# Altium schematic sheet T35_6_DDR3.SchDoc
size A4
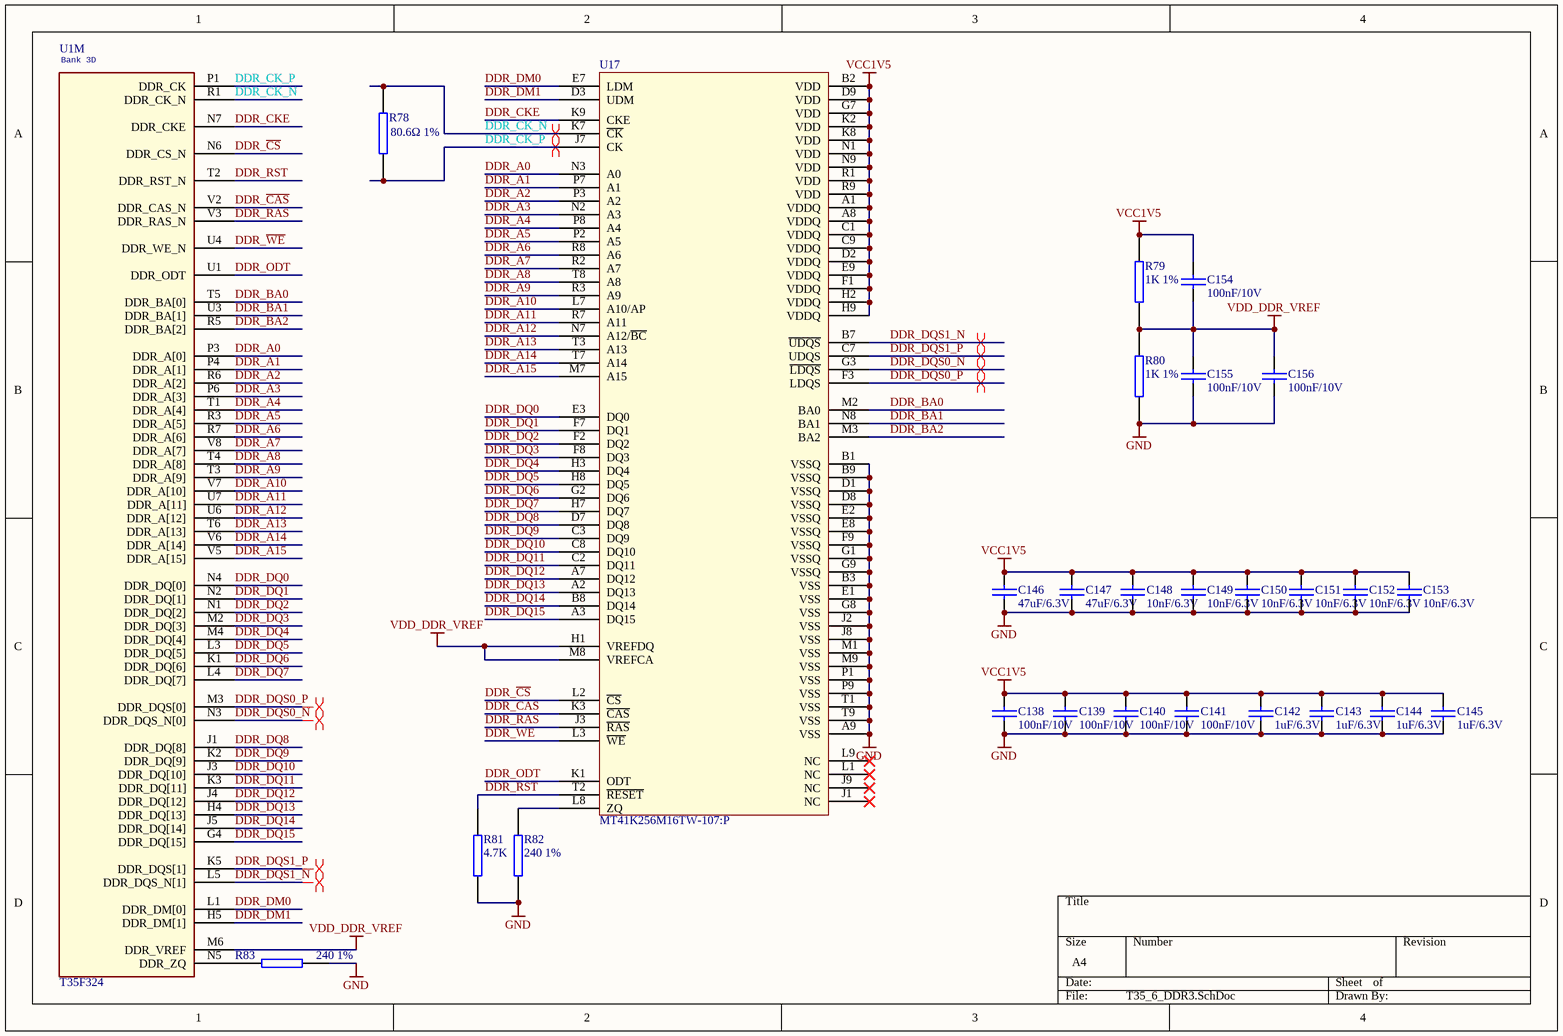
[diagram p0: T35_6_DDR3.SchDoc]

## Parts
C138  100nF/10V  [0201CS]
C139  100nF/10V  [0201CS]
C140  100nF/10V  [0201CS]
C141  100nF/10V  [0201CS]
C142  1uF/6.3V  [0201CS]
C143  1uF/6.3V  [0201CS]
C144  1uF/6.3V  [0201CS]
C145  1uF/6.3V  [0201CS]
C146  47uF/6.3V  [0603CS]
C147  47uF/6.3V  [0603CS]
C148  10nF/6.3V  [0201CS]
C149  10nF/6.3V  [0201CS]
C150  10nF/6.3V  [0201CS]
C151  10nF/6.3V  [0201CS]
C152  10nF/6.3V  [0201CS]
C153  10nF/6.3V  [0201CS]
C154  100nF/10V  [0201CS]
C155  100nF/10V  [0201CS]
C156  100nF/10V  [0201CS]
R78  80.6Ω 1%  [0402RS]
R79  1K 1%  [0402RS]
R80  1K 1%  [0402RS]
R81  4.7K  [0402RS]
R82  240 1%  [0201RS]
R83  240 1%  [0201RS]
U1  T35F324  [T35-F324-BGA100P9X9-81A]  (part M of 17)
U17  MT41K256M16TW-107:P  [MICT-TNA-96]

## Nets
GND: C138.2 C139.2 C140.2 C141.2 C142.2 C143.2 C144.2 C145.2 C146.2 C147.2 C148.2 C149.2 C150.2 C151.2 C152.2 C153.2 C155.2 C156.2 R80.1 R81.2 R82.2 R83.2 U17.A9(VSS) U17.B1(VSSQ) U17.B3(VSS) U17.B9(VSSQ) U17.D1(VSSQ) U17.D8(VSSQ) U17.E1(VSS) U17.E2(VSSQ) U17.E8(VSSQ) U17.F9(VSSQ) U17.G1(VSSQ) U17.G8(VSS) U17.G9(VSSQ) U17.J2(VSS) U17.J8(VSS) U17.M1(VSS) U17.M9(VSS) U17.P1(VSS) U17.P9(VSS) U17.T1(VSS) U17.T9(VSS)
VCC1V5: C138.1 C139.1 C140.1 C141.1 C142.1 C143.1 C144.1 C145.1 C146.1 C147.1 C148.1 C149.1 C150.1 C151.1 C152.1 C153.1 C154.1 R79.2 U17.A1(VDDQ) U17.A8(VDDQ) U17.B2(VDD) U17.C1(VDDQ) U17.C9(VDDQ) U17.D2(VDDQ) U17.D9(VDD) U17.E9(VDDQ) U17.F1(VDDQ) U17.G7(VDD) U17.H2(VDDQ) U17.H9(VDDQ) U17.K2(VDD) U17.K8(VDD) U17.N1(VDD) U17.N9(VDD) U17.R1(VDD) U17.R9(VDD)
VDD_DDR_VREF: C154.2 C155.1 C156.1 R79.1 R80.2 U1.M6(DDR_VREF) U17.H1(VREFDQ) U17.M8(VREFCA)
DDR_A0: U1.P3(DDR_A[0]) U17.N3(A0)
DDR_A1: U1.P4(DDR_A[1]) U17.P7(A1)
DDR_A2: U1.R6(DDR_A[2]) U17.P3(A2)
DDR_A3: U1.P6(DDR_A[3]) U17.N2(A3)
DDR_A4: U1.T1(DDR_A[4]) U17.P8(A4)
DDR_A5: U1.R3(DDR_A[5]) U17.P2(A5)
DDR_A6: U1.R7(DDR_A[6]) U17.R8(A6)
DDR_A7: U1.V8(DDR_A[7]) U17.R2(A7)
DDR_A8: U1.T4(DDR_A[8]) U17.T8(A8)
DDR_A9: U1.T3(DDR_A[9]) U17.R3(A9)
DDR_A10: U1.V7(DDR_A[10]) U17.L7(A10/AP)
DDR_A11: U1.U7(DDR_A[11]) U17.R7(A11)
DDR_A12: U1.U6(DDR_A[12]) U17.N7(A12/~{BC})
DDR_A13: U1.T6(DDR_A[13]) U17.T3(A13)
DDR_A14: U1.V6(DDR_A[14]) U17.T7(A14)
DDR_A15: U1.V5(DDR_A[15]) U17.M7(A15)
DDR_BA0: U1.T5(DDR_BA[0]) U17.M2(BA0)
DDR_BA1: U1.U3(DDR_BA[1]) U17.N8(BA1)
DDR_BA2: U1.R5(DDR_BA[2]) U17.M3(BA2)
DDR_~{CAS}: U1.V2(DDR_CAS_N) U17.K3(~{CAS})
DDR_~{CS}: U1.N6(DDR_CS_N) U17.L2(~{CS})
DDR_CK_N: R78.1 U1.R1(DDR_CK_N) U17.K7(~{CK})
DDR_CK_P: R78.2 U1.P1(DDR_CK) U17.J7(CK)
DDR_CKE: U1.N7(DDR_CKE) U17.K9(CKE)
DDR_DM0: U1.L1(DDR_DM[0]) U17.E7(LDM)
DDR_DM1: U1.H5(DDR_DM[1]) U17.D3(UDM)
DDR_DQ0: U1.N4(DDR_DQ[0]) U17.E3(DQ0)
DDR_DQ1: U1.N2(DDR_DQ[1]) U17.F7(DQ1)
DDR_DQ2: U1.N1(DDR_DQ[2]) U17.F2(DQ2)
DDR_DQ3: U1.M2(DDR_DQ[3]) U17.F8(DQ3)
DDR_DQ4: U1.M4(DDR_DQ[4]) U17.H3(DQ4)
DDR_DQ5: U1.L3(DDR_DQ[5]) U17.H8(DQ5)
DDR_DQ6: U1.K1(DDR_DQ[6]) U17.G2(DQ6)
DDR_DQ7: U1.L4(DDR_DQ[7]) U17.H7(DQ7)
DDR_DQ8: U1.J1(DDR_DQ[8]) U17.D7(DQ8)
DDR_DQ9: U1.K2(DDR_DQ[9]) U17.C3(DQ9)
DDR_DQ10: U1.J3(DDR_DQ[10]) U17.C8(DQ10)
DDR_DQ11: U1.K3(DDR_DQ[11]) U17.C2(DQ11)
DDR_DQ12: U1.J4(DDR_DQ[12]) U17.A7(DQ12)
DDR_DQ13: U1.H4(DDR_DQ[13]) U17.A2(DQ13)
DDR_DQ14: U1.J5(DDR_DQ[14]) U17.B8(DQ14)
DDR_DQ15: U1.G4(DDR_DQ[15]) U17.A3(DQ15)
DDR_DQS0_N: U1.N3(DDR_DQS_N[0]) U17.G3(~{LDQS})
DDR_DQS0_P: U1.M3(DDR_DQS[0]) U17.F3(LDQS)
DDR_DQS1_N: U1.L5(DDR_DQS_N[1]) U17.B7(~{UDQS})
DDR_DQS1_P: U1.K5(DDR_DQS[1]) U17.C7(UDQS)
DDR_ODT: U1.U1(DDR_ODT) U17.K1(ODT)
DDR_~{RAS}: U1.V3(DDR_RAS_N) U17.J3(~{RAS})
DDR_RST: R81.1 U1.T2(DDR_RST_N) U17.T2(~{RESET})
DDR_~{WE}: U1.U4(DDR_WE_N) U17.L3(~{WE})
NetR82_1: R82.1 U17.L8(ZQ)
NetR83_1: R83.1 U1.N5(DDR_ZQ)

Not connected (* = marked no-connect by the designer): U17 J1(NC)* J9(NC)* L1(NC)* L9(NC)*

## Layout directives
differential pair: DDR_CK_N, DDR_CK_P, DDR_DQS0_N, DDR_DQS0_P, DDR_DQS1_N, DDR_DQS1_P

## Notes on the sheet
- (in symbol T35F324, part M) Bank 3D

## Library data of the parts
C138-C156 = CAP: 贴片电容
  C138-C141 C154-C156: Link: https://item.szlcsc.com/456838.html
  C142-C145: Link: https://item.szlcsc.com/54083.html
  C146 C147: Link: https://item.szlcsc.com/152108.html
  C148-C153: Link: https://item.szlcsc.com/78065.html
R78-R83 = RES2: 贴片电阻
U1 = T35F324: FPGA芯片; SWAP_INFO: (S1+S2+S3+S4+S5+S6+S7+S8+S9+S10+S11+S12+S13+S14+S15+S16+S17); SPLIT_INST: TRUE
U17 = MT41K512M16HA-125IT: DDR3芯片